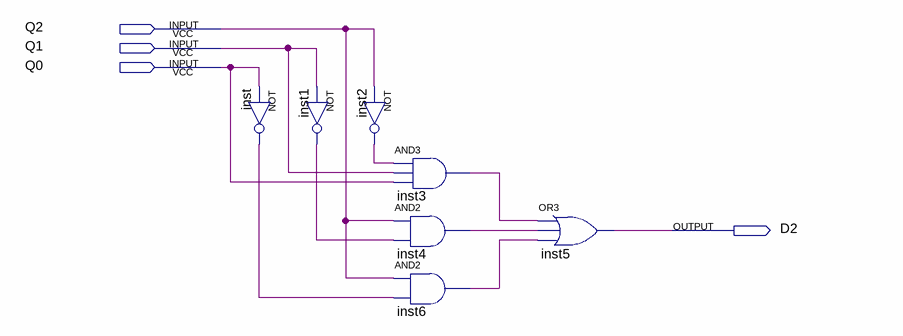
[diagram p0: schematic sheet]
// Quartus schematic D2.bdf as structural Verilog: 7 symbols, 4 pins
module D2 (
  input  Q2,
  input  Q1,
  input  Q0,
  output D2
);

  wire inst1_out, inst2_out, inst3_out, inst4_out, inst6_out, inst_out;

  not inst (inst_out, Q0);
  not inst1 (inst1_out, Q1);
  not inst2 (inst2_out, Q2);
  and inst3 (inst3_out, inst2_out, Q1, Q0);
  and inst4 (inst4_out, Q2, inst1_out);
  and inst6 (inst6_out, Q2, inst_out);
  or inst5 (D2, inst3_out, inst4_out, inst6_out);
endmodule
